# Altium project USB_UART_Module.PrjPcb
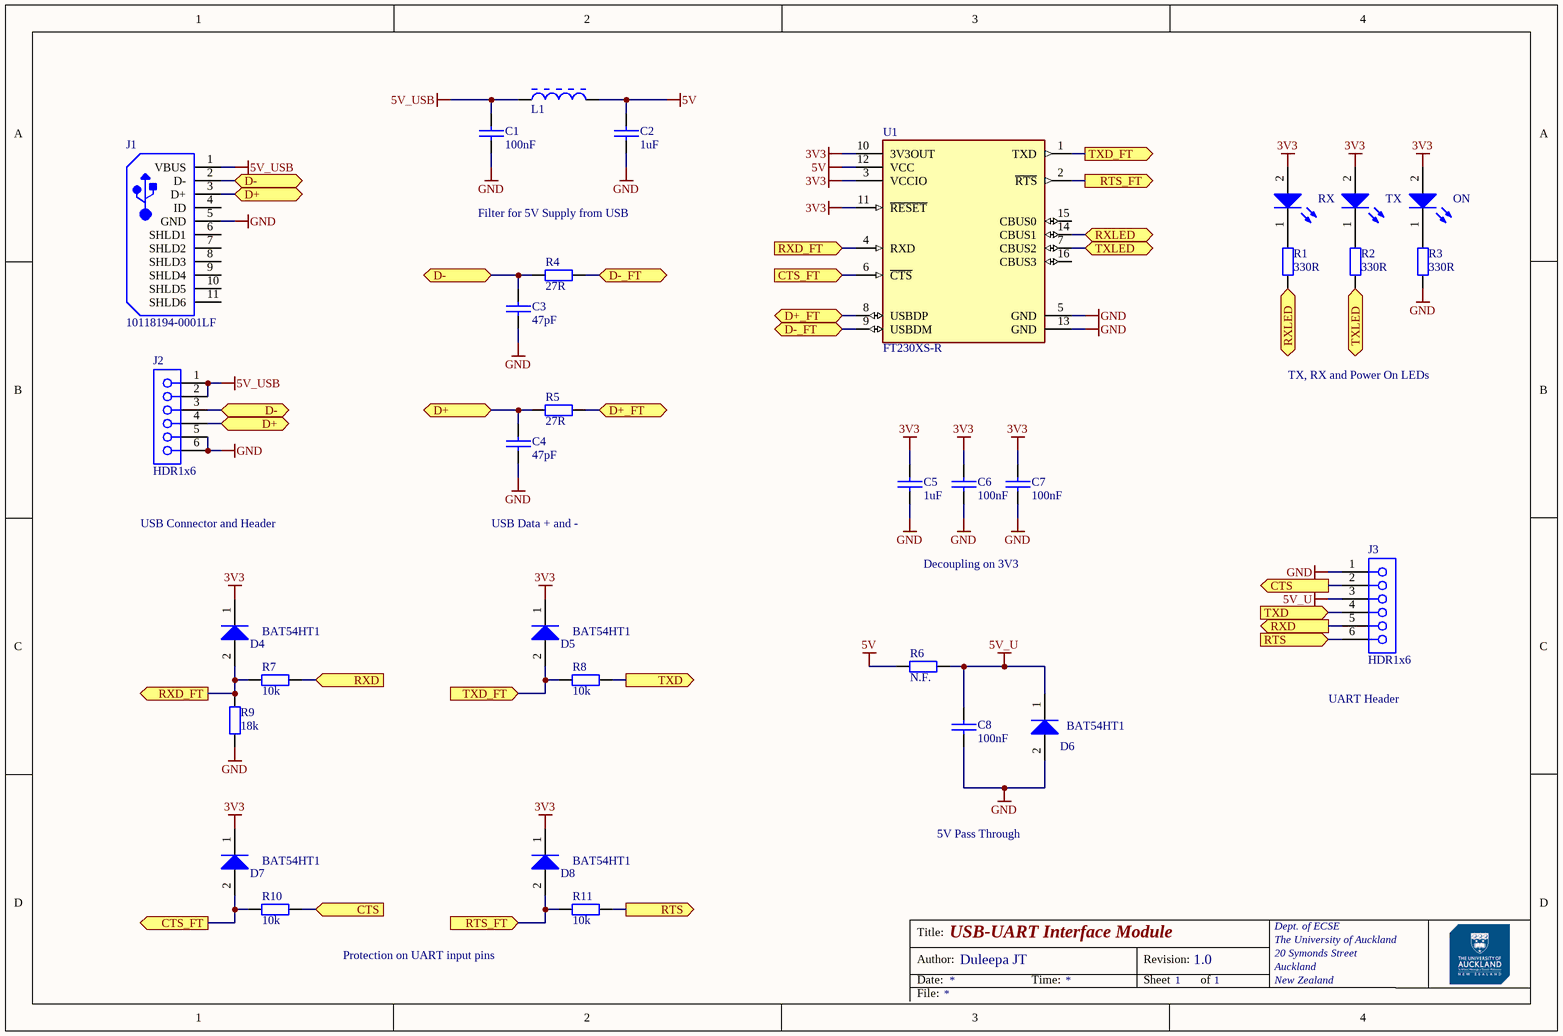
[diagram p0: USB_Interface_SCH.SchDoc]
1 sheet, 32 parts. Net scope: flat (ports and power ports of the same name join across sheets).
Board file: USB_Interface_PCB.PcbDoc

## Sheet USB_Interface_SCH.SchDoc: USB-UART Interface Module
size A4; Author: Duleepa JT; CompanyName: The University of Auckland; Organization: Dept. of ECSE; Address1: The University of Auckland; Address2: 20 Symonds Street; Address3: Auckland; Address4: New Zealand; Revision: 1.0; SheetNumber: 1; SheetTotal: 1

### Parts
C1  100nF  [C0805]
C2  1uF  [C0805]
C3  47pF  [C0805]
C4  47pF  [C0805]
C5  1uF  [C0805]
C6  100nF  [C0805]
C7  100nF  [C0805]
C8  100nF  [C0805]
D4  BAT54HT1  [ONSC-SOD-323-2-477-02_V]
D5  BAT54HT1  [ONSC-SOD-323-2-477-02_V]
D6  BAT54HT1  [ONSC-SOD-323-2-477-02_V]
D7  BAT54HT1  [ONSC-SOD-323-2-477-02_V]
D8  BAT54HT1  [ONSC-SOD-323-2-477-02_V]
J1  10118194-0001LF  [FCI-10118194-0001LF-5_V]
J2  HDR1x6  [SMTC-SSW-106-02-X-S]
J3  HDR1x6  [SMTC-SSW-106-02-X-S]
L1  FBMH3225HM102NT  [TAYO-3225-2_V]  (value not drawn)
ON  LGR971-KN-1  [FP-LG_R971-MFG]  (value not drawn)
R1  330R  [R0805]
R2  330R  [R0805]
R3  330R  [R0805]
R4  27R  [R0805]
R5  27R  [R0805]
R6  N.F.  [R0805]
R7  10k  [R0805]
R8  10k  [R0805]
R9  18k  [R0805]
R10  10k  [R0805]
R11  10k  [R0805]
RX  LGR971-KN-1  [FP-LG_R971-MFG]  (value not drawn)
TX  LSR976-NR-1  [FP-LS_R976-MFG]  (value not drawn)
U1  FT230XS-R  [FP-SSOP-16-IPC_C]

### Ports
CTS (in), CTS (out), CTS_FT (in), CTS_FT (out), D+ (bidir), D+_FT (bidir), D- (bidir), D-_FT (bidir), RTS (in), RTS (out), RTS_FT (in), RTS_FT (out), RXD (in), RXD (out), RXD_FT (in), RXD_FT (out), RXLED (bidir), TXD (in), TXD (out), TXD_FT (in), TXD_FT (out), TXLED (bidir)

### Nets
3V3: C5.1 C6.1 C7.2 D4.1(K) D5.1(K) D7.1(K) D8.1(K) ON.2(A) RX.2(A) TX.2(A) U1.3(VCCIO) U1.10(3V3OUT) U1.11(~{RESET})
5V: C2.1 L1.2 R6.1 U1.12(VCC)
5V_U: C8.2 D6.1(K) J3.3 R6.2
5V_USB: C1.1 J1.1(VBUS) J2.1 J2.2 L1.1
GND: C1.2 C2.2 C3.1 C4.1 C5.2 C6.2 C7.1 C8.1 D6.2(A) J1.5(GND) J2.5 J2.6 J3.1 R3.2 R9.2 U1.5(GND) U1.13(GND)
NetC3_2: C3.2 J1.2(D-) J2.3 R4.1 ; port D-
NetC4_2: C4.2 J1.3(D+) J2.4 R5.1 ; port D+
NetD4_2: D4.2(A) R7.1 R9.1 U1.4(RXD) ; port RXD_FT
NetD5_2: D5.2(A) R8.1 U1.1(TXD) ; port TXD_FT
NetD7_2: D7.2(A) R10.1 U1.6(~{CTS}) ; port CTS_FT
NetD8_2: D8.2(A) R11.1 U1.2(~{RTS}) ; port RTS_FT
NetJ3_2: J3.2 R10.2 ; port CTS
NetJ3_4: J3.4 R8.2 ; port TXD
NetJ3_5: J3.5 R7.2 ; port RXD
NetJ3_6: J3.6 R11.2 ; port RTS
NetON_1: ON.1(C) R3.1
NetR1_1: R1.1 RX.1(C)
NetR1_2: R1.2 U1.14(CBUS1) ; port RXLED
NetR2_1: R2.1 TX.1(C)
NetR2_2: R2.2 U1.7(CBUS2) ; port TXLED
NetR4_2: R4.2 U1.9(USBDM) ; port D-_FT
NetR5_2: R5.2 U1.8(USBDP) ; port D+_FT

Not connected (* = marked no-connect by the designer): J1 4(ID) 6(SHLD1) 7(SHLD2) 8(SHLD3) 9(SHLD4) 10(SHLD5) 11(SHLD6); U1 15(CBUS0) 16(CBUS3)

### Notes on the sheet
- Filter for 5V Supply from USB
- TX, RX and Power On LEDs
- USB Connector and Header
- USB Data + and -
- Decoupling on 3V3
- UART Header
- 5V Pass Through
- Protection on UART input pins
- Title:
- Author:
- Date:
- Time:
- Revision:
- Sheet
- of
- File:

### Library data of the parts
C1-C8 = CCAP0805
  C1 C6-C8: Value: 100nF; LCSC Part Number: C62912; JLC Part Number: CL21B104JBCNNNC
  C2: Value: 1uF; LCSC Part Number: C28323; JLC Part: CL21B105KBFNNNE
  C3 C4: Value: 47pF; LCSC Part Number: C14857; JLC Part: CL21C470JBANNNC
  C5: Value: 1uF; LCSC Part Number: C28323; JLC Part Number: CL21B105KBFNNNE
D4-D8 = CMP-004-00000-1: DIODE SCHOTTKY 30V 200MA SOD323; LCSC Part Number: C21107
J1 = CMP-00028-00000-1: CONN USB MICRO B RECPT SMT R/A
J2 J3 = CMP-002-00001-2: CONN RCPT 6POS 0.1 TIN PCB
L1 = CMP-006-00000-1: TAIYO YUDEN         FBMH3225HM102NT            Ferrite Case Style:1210 [3225 Metric]; LCSC Part Number: C124093
ON RX = CMP-007-00001-2: LED Uni-Color Green 572nm 2-Pin SMD T/R; LCSC Part Number: C2297
R1-R11 = RES0805
  R1-R3: Value: 330R; LCSC Part Number: C17630
  R4 R5: Value: 27R; LCSC Part Number: C17594
  R6: Value: N.F.; LCSC Part Number: *
  R7 R8 R10 R11: Value: 10k; LCSC Part Number: C17414
  R9: Value: 18k; LCSC Part Number: C17506
TX = CMP-007-00000-2: LED RED DIFFUSED 0805 SMD; LCSC Part Number: C84256
U1 = CMP-015-00001-2: USB-to-UART 1-CH 512byte FIFO 5V 16-Pin SSOP T/R; LCSC Part Number: C69082